# Altium project tx.PrjPcb
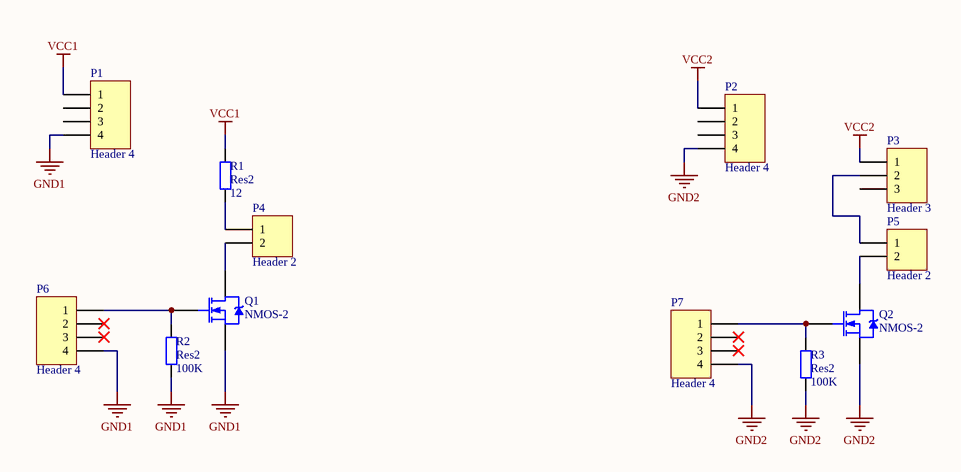
[diagram p0: Sheet2.SchDoc]
1 sheet, 12 parts. Net scope: global (net labels, ports and power ports of the same name join across sheets).
Board file: PCB1.PcbDoc

## Sheet Sheet2.SchDoc
size A

### Parts
P1  Header 4  [HDR1X4]
P2  Header 4  [HDR1X4]
P3  Header 3  [HDR1X3]
P4  Header 2  [HDR1X2]
P5  Header 2  [HDR1X2]
P6  Header 4  [HDR1X4]
P7  Header 4  [HDR1X4]
Q1  NMOS-2  [TO-220AB]
Q2  NMOS-2  [TO-220AB]
R1  Res2  value 12  [AXIAL-0.4]
R2  Res2  value 100K  [AXIAL-0.4]
R3  Res2  value 100K  [AXIAL-0.4]

### Nets
GND1: P1.4 P6.4 Q1.3(S) R2.1
GND2: P2.4 P7.4 Q2.3(S) R3.1
VCC1: P1.1 R1.2
VCC2: P2.1 P3.1
NetP3_2: P3.2 P5.1
NetP4_1: P4.1 R1.1
NetP4_2: P4.2 Q1.2(D)
NetP5_2: P5.2 Q2.2(D)
NetP6_1: P6.1 Q1.1(G) R2.2
NetP7_1: P7.1 Q2.1(G) R3.2

Not connected (* = marked no-connect by the designer): P1 2 3; P2 2 3; P3 3; P6 2* 3*; P7 2* 3*

### Library data of the parts
P1 P2 P6 P7 = Header 4: Header, 4-Pin; LatestRevisionDate: 17-Jul-2002; LatestRevisionNote: Re-released for DXP Platform.; Publisher: Altium Limited
P3 = Header 3: Header, 3-Pin; LatestRevisionDate: 17-Jul-2002; LatestRevisionNote: Re-released for DXP Platform.; Publisher: Altium Limited
P4 P5 = Header 2: Header, 2-Pin; LatestRevisionDate: 17-Jul-2002; LatestRevisionNote: Re-released for DXP Platform.; Publisher: Altium Limited
Q1 Q2 = NMOS-2: N-Channel Power MOSFET; Note: Pin 2 is electrically connected to pin 4.; Published: 8-Jun-2000; LatestRevisionDate: 17-Jul-2002; LatestRevisionNote: Re-released for DXP Platform.; DatasheetVersion: PD-9.814; PackageVersion: Feb-1997; PackageReference: TO-220AB; Publisher: Altium Limited; PackageDescription: TO, Thru-Hole, Vertical, Heatsink Mounted; 3 In-Line Leads; Pitch 2.54 mm; ComponentLink1Description: Manufacturer Link; ComponentLink1URL: http://www.irf.com/
R1-R3 = Res2: Resistor; Published: 8-Jun-2000; LatestRevisionDate: 17-Jul-2002; LatestRevisionNote: Re-released for DXP Platform.; PackageReference: AXIAL-0.4; Publisher: Altium Limited; PackageDescription: Axial Device, Thru-Hole; 2 Leads; 0.4 in Pin Spacing